# Altium schematic sheet Controller_Board_Interface.SchDoc
size Letter; Organization: Midnight Sun Solar Rayce Car Team; Address1: University of Waterloo; Address2: 200 University Ave W; Address3: Waterloo, ON, Canada; Address4: N2L 3E9; Website: www.uwmidsun.com
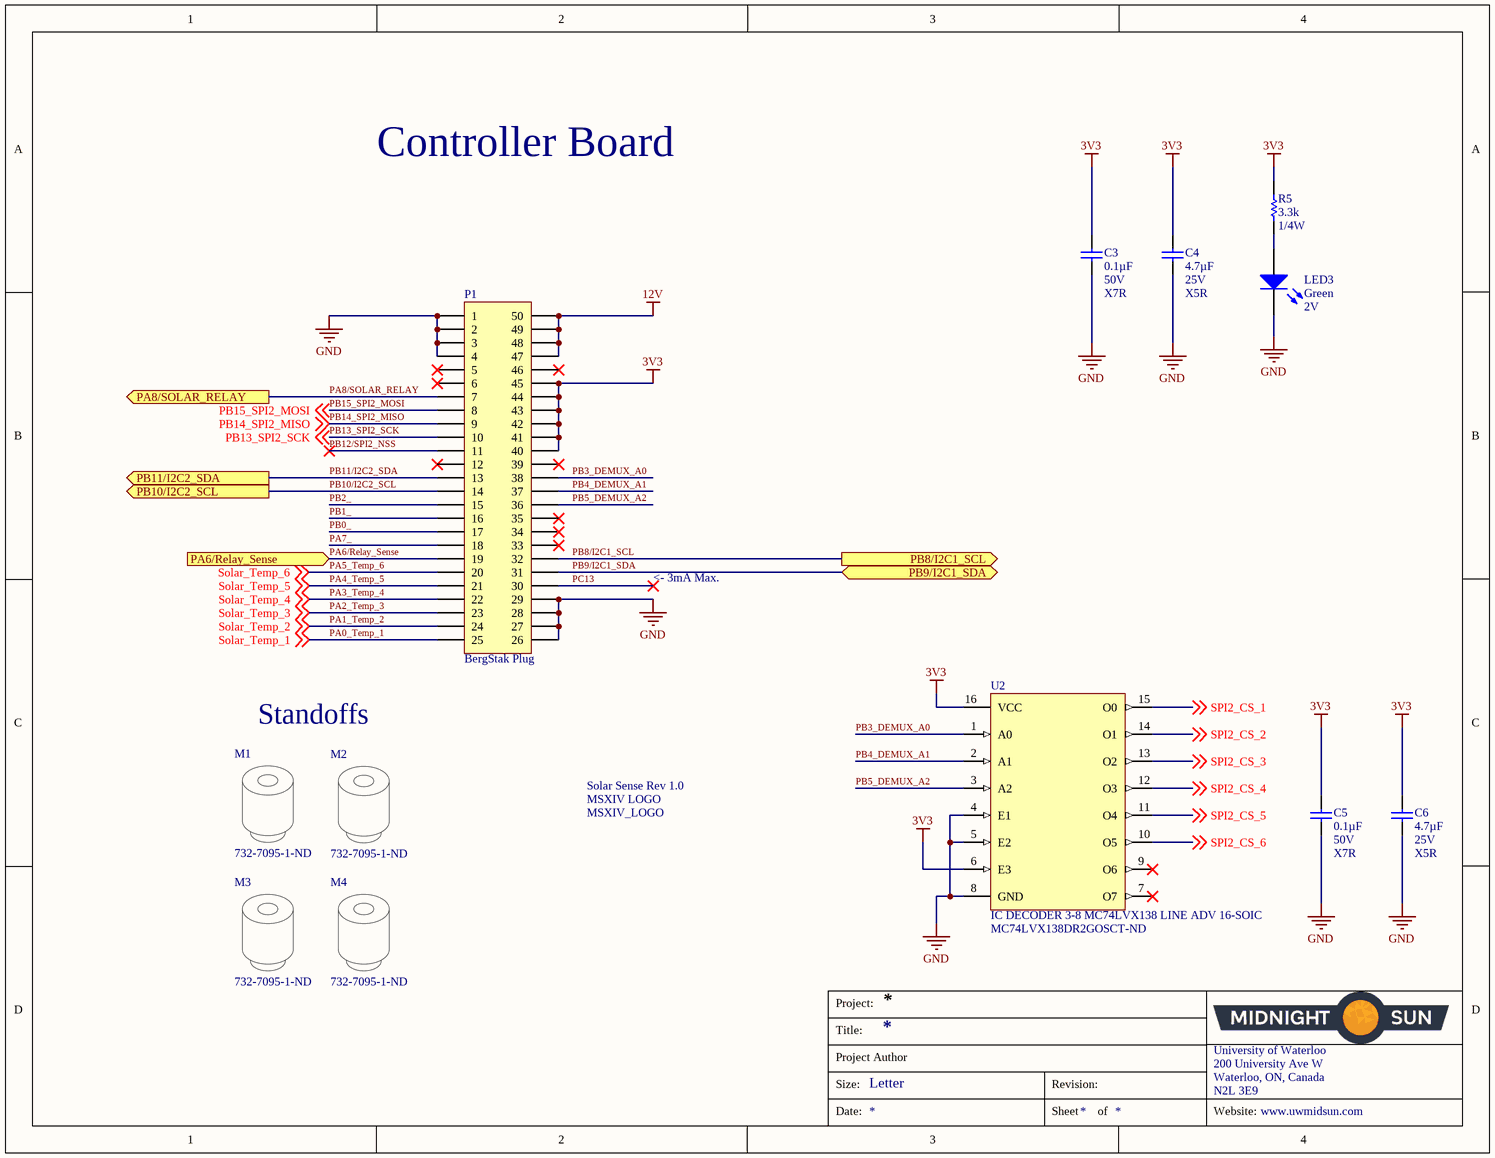
[diagram p0: Controller_Board_Interface.SchDoc]

## Parts
C3  Capacitance: 0.1µF  Voltage: 50V  Temperature Coefficient: X7R  [CAP, 0603]  (hidden comment: CAP CER 0.1UF 50V 10% X7R 0603)
C4  Capacitance: 4.7µF  Voltage: 25V  Temperature Coefficient: X5R  [CAP, 0603]  (hidden comment: CAP CER 4.7UF 25V 10% X5R 0603)
C5  Capacitance: 0.1µF  Voltage: 50V  Temperature Coefficient: X7R  [CAP, 0603]  (hidden comment: CAP CER 0.1UF 50V 10% X7R 0603)
C6  Capacitance: 4.7µF  Voltage: 25V  Temperature Coefficient: X5R  [CAP, 0603]  (hidden comment: CAP CER 4.7UF 25V 10% X5R 0603)
LED3  Color: Green  Voltage - Forward (Vf) (Typ): 2V  [LED_0603]  (hidden comment: LED GREEN CLEAR 2V 0603)
M1  Supplier Part Number 1: 732-7095-1-ND  [M2.5 Standoff]  (hidden comment: STANDOFF RND M2.5X0.45 STEEL 5MM)
M2  Supplier Part Number 1: 732-7095-1-ND  [M2.5 Standoff]  (hidden comment: STANDOFF RND M2.5X0.45 STEEL 5MM)
M3  Supplier Part Number 1: 732-7095-1-ND  [M2.5 Standoff]  (hidden comment: STANDOFF RND M2.5X0.45 STEEL 5MM)
M4  Supplier Part Number 1: 732-7095-1-ND  [M2.5 Standoff]  (hidden comment: STANDOFF RND M2.5X0.45 STEEL 5MM)
P1  Series: BergStak Plug  [CONN, Bergstak 50 Pos Plug]  (hidden comment: CONN 50POS Bergstak Plug 0.02")
R5  Resistance: 3.3k  Power: 1/4W  [RES, 0603]  (hidden comment: RES 3.3K OHM 1% 1/4W 0603)
Solar_Sense_Rev_1.0  MSXIV_LOGO  [MSXIV LOGO]
U2  IC DECODER 3-8 MC74LVX138 LINE ADV 16-SOIC  Supplier Part Number 1: MC74LVX138DR2GOSCT-ND  [SOIC-16 CASE 751B-05 ISSUE K MC74LVX138]

## Ports
PA6/Relay_Sense (in), PA8/SOLAR_RELAY (out), PB8/I2C1_SCL (out), PB9/I2C1_SDA (bidir), PB10/I2C2_SCL (out), PB11/I2C2_SDA (out)

## Nets
3V3: C3.1 C4.1 C5.1 C6.1 P1.40 P1.41 P1.42 P1.43 P1.44 P1.45 R5.1 U2.6(E3) U2.16(VCC)
12V: P1.47 P1.48 P1.49 P1.50
GND: C3.2 C4.2 C5.2 C6.2 LED3.2(K) P1.1 P1.2 P1.3 P1.4 P1.26 P1.27 P1.28 P1.29 U2.4(E1) U2.5(E2) U2.8(GND)
PA0_Temp_1: P1.25 ; off-sheet Solar_Temp_1  [also labelled Solar_Temp_1]
PA1_Temp_2: P1.24 ; off-sheet Solar_Temp_2  [also labelled Solar_Temp_2]
PA2_Temp_3: P1.23 ; off-sheet Solar_Temp_3  [also labelled Solar_Temp_3]
PA3_Temp_4: P1.22 ; off-sheet Solar_Temp_4  [also labelled Solar_Temp_4]
PA4_Temp_5: P1.21 ; off-sheet Solar_Temp_5  [also labelled Solar_Temp_5]
PA5_Temp_6: P1.20 ; off-sheet Solar_Temp_6  [also labelled Solar_Temp_6]
PA6/Relay_Sense: P1.19 ; port PA6/Relay_Sense
PA7_: P1.18
PA8/SOLAR_RELAY: P1.7 ; port PA8/SOLAR_RELAY
PB0_: P1.17
PB1_: P1.16
PB2_: P1.15
PB3_DEMUX_A0: P1.38 U2.1(A0)
PB4_DEMUX_A1: P1.37 U2.2(A1)
PB5_DEMUX_A2: P1.36 U2.3(A2)
PB8/I2C1_SCL: P1.32 ; port PB8/I2C1_SCL
PB9/I2C1_SDA: P1.31 ; port PB9/I2C1_SDA
PB10/I2C2_SCL: P1.14 ; port PB10/I2C2_SCL
PB11/I2C2_SDA: P1.13 ; port PB11/I2C2_SDA
PB12/SPI2_NSS: P1.11
PB13_SPI2_SCK: P1.10 ; off-sheet PB13_SPI2_SCK
PB14_SPI2_MISO: P1.9 ; off-sheet PB14_SPI2_MISO
PB15_SPI2_MOSI: P1.8 ; off-sheet PB15_SPI2_MOSI
PC13: P1.30
SPI2_CS_1: U2.15(O0) ; off-sheet SPI2_CS_1
SPI2_CS_2: U2.14(O1) ; off-sheet SPI2_CS_2
SPI2_CS_3: U2.13(O2) ; off-sheet SPI2_CS_3
SPI2_CS_4: U2.12(O3) ; off-sheet SPI2_CS_4
SPI2_CS_5: U2.11(O4) ; off-sheet SPI2_CS_5
SPI2_CS_6: U2.10(O5) ; off-sheet SPI2_CS_6
NetLED3_1: LED3.1(A) R5.2

Not connected (* = marked no-connect by the designer): P1 5* 6* 12* 33* 34* 35* 39* 46*; U2 7(O7)* 9(O6)*

## Notes on the sheet
- Controller Board
- <- 3mA Max.
- Standoffs
- Project:
- Title:
- Size:
- Project Author
- Letter
- Revision:
- University of Waterloo
- 200 University Ave W
- Waterloo, ON, Canada
- N2L 3E9
- Date:
- Sheet
- of
- Website:
- (in symbol MSXIV_LOGO) MSXIV LOGO

## Library data of the parts
C3 C5 = CAP CER 0.1UF 50V 10% X7R 0603: 0.10µF ±10% 50V Ceramic Capacitor X7R 0603 (1608 Metric); Manufacturer 1: AVX Corporation; Manufacturer Part Number 1: 06035C104KAT2A; Supplier 1: Digi-Key; Supplier Part Number 1: 478-5052-1-ND; Packaging: Cut Tape (CT); Part Status: Active; Operating Temperature: -55°C ~ 125°C; Ratings: -; Mounting Type: Surface Mount, MLCC; Package / Case: 0603 (1608 Metric); Size / Dimension: 0.063" L x 0.032" W (1.60mm x 0.81mm); Height - Seated (Max): -; Thickness (Max): 0.035" (0.90mm); Lead Spacing: -; Lead Style: -; ComponentLink1URL: http://datasheets.avx.com/X7RDielectric.pdf; ComponentLink1Description: http://datasheets.avx.com/X7RDielectric.pdf; Tolerance: ±10%
C4 C6 = CAP CER 4.7UF 25V 10% X5R 0603: 4.7µF ±10% 25V Ceramic Capacitor X5R 0603 (1608 Metric); Manufacturer 1: Murata Electronics North America; Manufacturer Part Number 1: GRM188R61E475KE11D; Supplier 1: Digi-Key; Supplier Part Number 1: 490-7203-1-ND; Packaging: Cut Tape (CT); Part Status: Active; Operating Temperature: -55°C ~ 85°C; Ratings: -; Mounting Type: Surface Mount, MLCC; Package / Case: 0603 (1608 Metric); Size / Dimension: 0.063" L x 0.031" W (1.60mm x 0.80mm); Height - Seated (Max): -; Thickness (Max): 0.031" (0.80mm); Lead Spacing: -; Lead Style: -; ComponentLink1URL: http://www.murata.com/~/media/webrenewal/support/library/catalog/products/capacitor/mlcc/c02e.ashx; ComponentLink1Description: http://www.murata.com/~/media/webrenewal/support/library/catalog/products/capacitor/mlcc/c02e.ashx; Tolerance: ±10%
LED3 = LED GREEN CLEAR 2V 0603: Green 572nm LED Indication - Discrete 2V 0603 (1608 Metric); Manufacturer: Wurth Electronics Inc.; Manufacturer Part Number: 150060VS75000; Lens Color: Colorless; Millicandela Rating: 40mcd; Lens Style/Size: Rectangle with Flat Top, 1.10mm x 0.70mm; Current - Test: 20mA; Viewing Angle: 140°; Wavelength - Dominant: 570nm; Supplier 1: Digi-Key; RoHS: RoHS Compliant; Category: Optoelectronics; Stock 1: 9408; Pricing 1: 1=0.21, 100=0.1617, 500=0.13964 (CAD); Packaging: Cut Tape (CT); Part Status: Active; Lens Transparency: Clear; Mounting Type: Surface Mount; Wavelength - Peak: 572nm; Features: -; Package / Case: 0603 (1608 Metric); Supplier Device Package: 0603; Size / Dimension: 1.60mm L x 0.80mm W; Height (Max): 0.80mm; ComponentLink1URL: http://katalog.we-online.de/led/datasheet/150060VS75000.pdf; ComponentLink1Description: http://katalog.we-online.de/led/datasheet/150060VS75000.pdf; Supplier Part Number 1: 732-4980-1-ND
M1-M4 = STANDOFF RND M2.5X0.45 STEEL 5MM: Manufacturer: Wurth Electronics; Manufacturer Part Number: 9774050151R; Plating: Tin; Threaded/Unthreaded: Threaded; Outside Diameter: 0.201inch; Supplier 1: Digi-Key; RoHS: Yes; Stock 1: 24846; Pricing 1: 1 = 1.09000, 10 = 1.03000, 50 = 0.91800, 100 = 0.84000 (USD); Material: Steel; Length: 0.252inch; REACH SVHC: Unknown
P1 = CONN 50POS Bergstak Plug 0.02": 50 Position Connector Plug, Outer Shroud Contacts Surface Mount Gold; Manufacturer 1: Amphenol FCI; Manufacturer Part Number 1: 10132797-055100LF; Number of Positions: 50; Mated Stacking Heights: 5mm; Pitch: 0.020" (0.50mm); Supplier 1: Digi-Key; Supplier Part Number 1: 609-5226-1-ND; Packaging: Cut Tape (CT); Part Status: Active; Connector Type: Plug, Outer Shroud Contacts; Number of Rows: 2; Mounting Type: Surface Mount; Contact Finish: Gold; Contact Finish Thickness: 1µin (0.025µm); Height Above Board: 0.169" (4.30mm); ComponentLink1URL: http://portal.fciconnect.com/Comergent//fci/drawing/10132797.pdf; ComponentLink1Description: http://portal.fciconnect.com/Comergent//fci/drawing/10132797.pdf
R5 = RES 3.3K OHM 1% 1/4W 0603: 3.3k Ohm ±1% 0.25W, 1/4W Chip Resistor 0603 (1608 Metric) Automotive AEC-Q200, Pulse Withstanding Thick Film; Manufacturer 1: Panasonic Electronic Components; Manufacturer Part Number 1: ERJ-PA3F3301V; Temperature Coefficient: ±100ppm/°C; Supplier 1: Digi-Key; Supplier Part Number 1: P3.3KBYCT-ND; Packaging: Cut Tape (CT); Part Status: Active; Composition: Thick Film; Operating Temperature: -55°C ~ 155°C; Package / Case: 0603 (1608 Metric); Supplier Device Package: 0603; Size / Dimension: 0.063" L x 0.031" W (1.60mm x 0.80mm); Height - Seated (Max): 0.022" (0.55mm); Failure Rate: -; ComponentLink1URL: https://industrial.panasonic.com/cdbs/www-data/pdf/RDO0000/AOA0000C291.pdf; ComponentLink1Description: https://industrial.panasonic.com/cdbs/www-data/pdf/RDO0000/AOA0000C291.pdf; Tolerance: ±1%
U2 = IC DECODER 3-8 MC74LVX138 LINE ADV 16-SOIC: Decoder/Demultiplexer 1 x 3:8 16-SOIC; Manufacturer: ON Semiconductor; Manufacturer Part Number: MC74LVX138DR2G; Number of Inputs: 3; Number of Outputs: 8; Propagation Delay: 23ns; Max Supply Voltage: 3.6V; Min Supply Voltage: 2V; Logic Function: Demultiplexer,Decoder; Number of Elements: 1; High Level Output Current: 4mA; Polarity: Inverting; Quiescent Current: 4uA; Supply Type: Single; Supplier 1: Digi-Key; RoHS: Yes; Category: Decoders, Multiplexers; Stock 1: 2170; Pricing 1: 1=0.45000, 10=0.36100, 100=0.24590, 500=0.18442, 1000=0.13831 (USD); Mount: Surface Mount; Case/Package: SOIC; Number of Pins: 16; Min Operating Temperature: -40°C; Max Operating Temperature: 85°C; Packaging: Tape and Reel; Package Quantity: 2500; Low Level Output Current: 4mA; Number of Input Lines: 3; Number of Output Lines: 8; Turn-On Delay Time: 23ns; Independent Circuits: 1; Length: 10mm; Height: 1.5mm; Width: 4mm; Lead Free: Lead Free; Halogen Free: Halogen Free; ComponentLink1URL: https://datasheet.ciiva.com/6615/mc74lvx138-d-6615404.pdf?src-supplier=Digi-Key; ComponentLink1Description: https://datasheet.ciiva.com/6615/mc74lvx138-d-6615404.pdf?src-supplier=Digi-Key; ComponentLink2URL: https://datasheet.ciiva.com/16386/mc74lvx138-d-16386958.pdf?src-supplier=Future+Electronics; ComponentLink2Description: https://datasheet.ciiva.com/16386/mc74lvx138-d-16386958.pdf?src-supplier=Future+Electronics; ComponentLink3URL: https://datasheet.ciiva.com/6615/mc74lvx138-d-6615402.pdf?src-supplier=Digi-Key; ComponentLink3Description: https://datasheet.ciiva.com/6615/mc74lvx138-d-6615402.pdf?src-supplier=Digi-Key; ComponentLink4URL: https://datasheet.ciiva.com/6615/mc74lvx138-d-6615405.pdf?src-supplier=Digi-Key; ComponentLink4Description: https://datasheet.ciiva.com/6615/mc74lvx138-d-6615405.pdf?src-supplier=Digi-Key